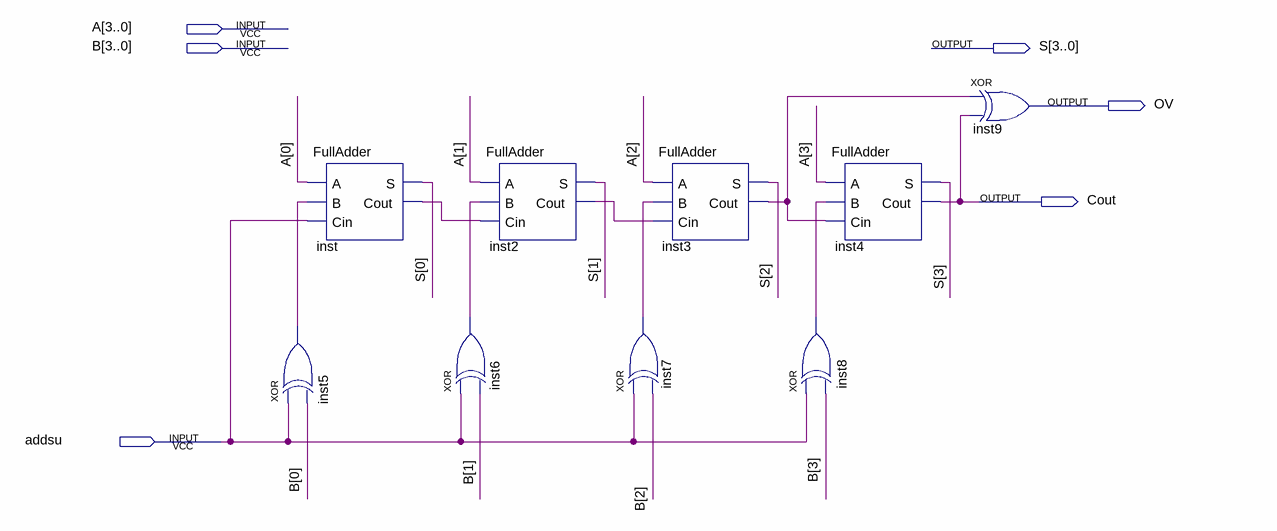
[diagram p0: schematic sheet]
// Quartus schematic AddSub4.bdf as structural Verilog: 9 symbols, 6 pins
module AddSub4 (
  input  [3:0] A,
  input  [3:0] B,
  input  addsu,
  output [3:0] S,
  output OV,
  output Cout
);

  wire inst2_cout, inst3_cout, inst5_out, inst6_out, inst7_out, inst8_out, inst_cout;

  xor inst5 (inst5_out, addsu, B[0]);
  FullAdder inst (.A(A[0]), .B(inst5_out), .Cin(addsu), .S(S[0]), .Cout(inst_cout));
  FullAdder inst2 (.A(A[1]), .B(inst6_out), .Cin(inst_cout), .S(S[1]), .Cout(inst2_cout));
  xor inst6 (inst6_out, addsu, B[1]);
  FullAdder inst3 (.A(A[2]), .B(inst7_out), .Cin(inst2_cout), .S(S[2]), .Cout(inst3_cout));
  xor inst7 (inst7_out, addsu, B[2]);
  xor inst8 (inst8_out, addsu, B[3]);
  FullAdder inst4 (.A(A[3]), .B(inst8_out), .Cin(inst3_cout), .S(S[3]), .Cout(Cout));
  xor inst9 (OV, inst3_cout, Cout);
endmodule
